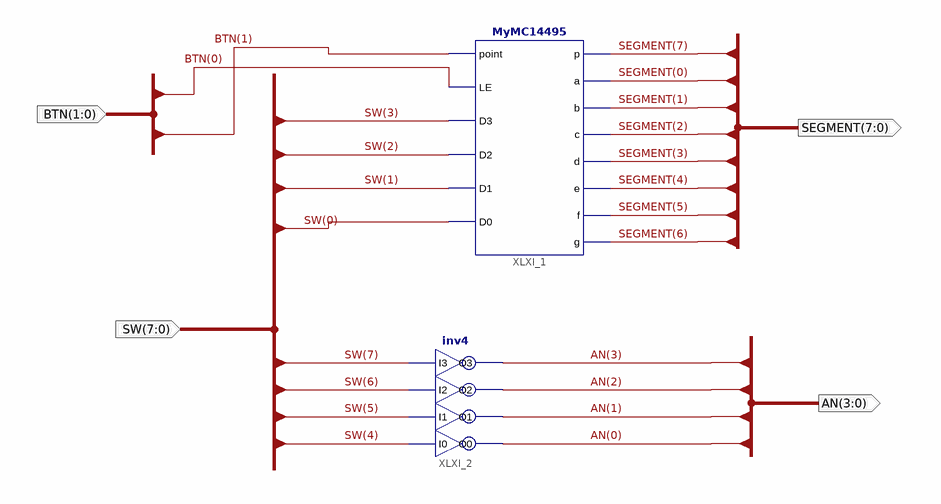
[diagram p0: schematic sheet 1]
// Xilinx ISE schematic DispNumber_sch.sch (kintex7) as structural Verilog: 2 symbols, 4 ports
module DispNumber_sch (
  input  [1:0] BTN,
  input  [7:0] SW,
  output [3:0] AN,
  output [7:0] SEGMENT
);

  MyMC14495 XLXI_1 (
    .point(BTN[1]), .LE(BTN[0]), .D3(SW[3]), .D2(SW[2]), .D1(SW[1]), .D0(SW[0]), .p(SEGMENT[7]),
    .a(SEGMENT[0]), .b(SEGMENT[1]), .c(SEGMENT[2]), .d(SEGMENT[3]), .e(SEGMENT[4]), .f(SEGMENT[5]),
    .g(SEGMENT[6]));
  inv4 XLXI_2 (.I0(SW[4]), .I1(SW[5]), .I2(SW[6]), .I3(SW[7]), .O0(AN[0]), .O1(AN[1]), .O2(AN[2]), .O3(AN[3]));
endmodule
